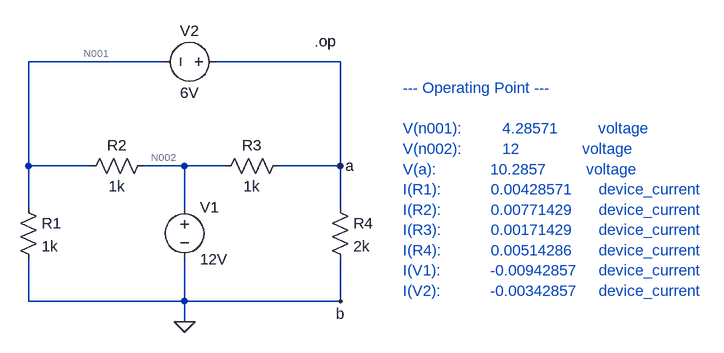
[diagram p0: schematic Draft1.asc]
Draft1.asc, the LTspice schematic file:
Version 4
SHEET 1 1132 680
WIRE 256 -48 48 -48
WIRE 528 -48 336 -48
WIRE 48 112 48 -48
WIRE 144 112 48 112
WIRE 288 112 224 112
WIRE 352 112 288 112
WIRE 528 112 528 -48
WIRE 528 112 432 112
WIRE 48 176 48 112
WIRE 288 176 288 112
WIRE 528 176 528 112
WIRE 48 320 48 256
WIRE 288 320 288 256
WIRE 288 320 48 320
WIRE 528 320 528 256
WIRE 528 320 288 320
WIRE 288 352 288 320
FLAG 528 112 a
FLAG 528 320 b
FLAG 288 352 0
SYMBOL res 32 160 R0
SYMATTR InstName R1
SYMATTR Value 1k
SYMBOL res 240 96 R90
WINDOW 0 0 56 VBottom 2
WINDOW 3 32 56 VTop 2
SYMATTR InstName R2
SYMATTR Value 1k
SYMBOL res 336 128 R270
WINDOW 0 32 56 VTop 2
WINDOW 3 0 56 VBottom 2
SYMATTR InstName R3
SYMATTR Value 1k
SYMBOL res 512 160 R0
SYMATTR InstName R4
SYMATTR Value 2k
SYMBOL voltage 288 160 R0
SYMATTR InstName V1
SYMATTR Value 12V
SYMBOL voltage 352 -48 R90
WINDOW 0 -32 56 VBottom 2
WINDOW 3 32 56 VTop 2
SYMATTR InstName V2
SYMATTR Value 6V
TEXT 488 -80 Left 2 !.op
TEXT 624 -8 Left 2 ;--- Operating Point ---\n \nV(n001):         4.28571         voltage\nV(n002):         12              voltage\nV(a):            10.2857         voltage\nI(R1):           0.00428571      device_current\nI(R2):           0.00771429      device_current\nI(R3):           0.00171429      device_current\nI(R4):           0.00514286      device_current\nI(V1):           -0.00942857     device_current\nI(V2):           -0.00342857     device_current

The netlist it stands for:
* Draft1.asc
R1 N001 0 1k
R2 N002 N001 1k
R3 N002 a 1k
R4 a 0 2k
V1 N002 0 12V
V2 a N001 6V
.op
* --- Operating Point ---
* V(n001):         4.28571         voltage
* V(n002):         12              voltage
* V(a):            10.2857         voltage
* I(R1):           0.00428571      device_current
* I(R2):           0.00771429      device_current
* I(R3):           0.00171429      device_current
* I(R4):           0.00514286      device_current
* I(V1):           -0.00942857     device_current
* I(V2):           -0.00342857     device_current
.backanno
.end

* Results of the author's LTspice run, read from the files saved beside the schematic
* Operating Point:
*   V(n001) = 4.286 V
*   V(n002) = 12 V
*   V(a) = 10.29 V
*   I(R1) = 4.286 mA
*   I(R2) = 7.714 mA
*   I(R3) = 1.714 mA
*   I(R4) = 5.143 mA
*   I(V1) = -9.429 mA
*   I(V2) = -3.429 mA